# EasyEDA Pro project sardines-drying-circuit.eprj

# Schematic Schematic1
Board Name: Board1; Create Date: 2025-08-19; Page Name: P1; Project Name: sardines-drying-circuit; Schematic Name: Schematic1; Update Date: 2025-08-20; Company: EasyEDA.com; Page Size: A4; Version: V1.0
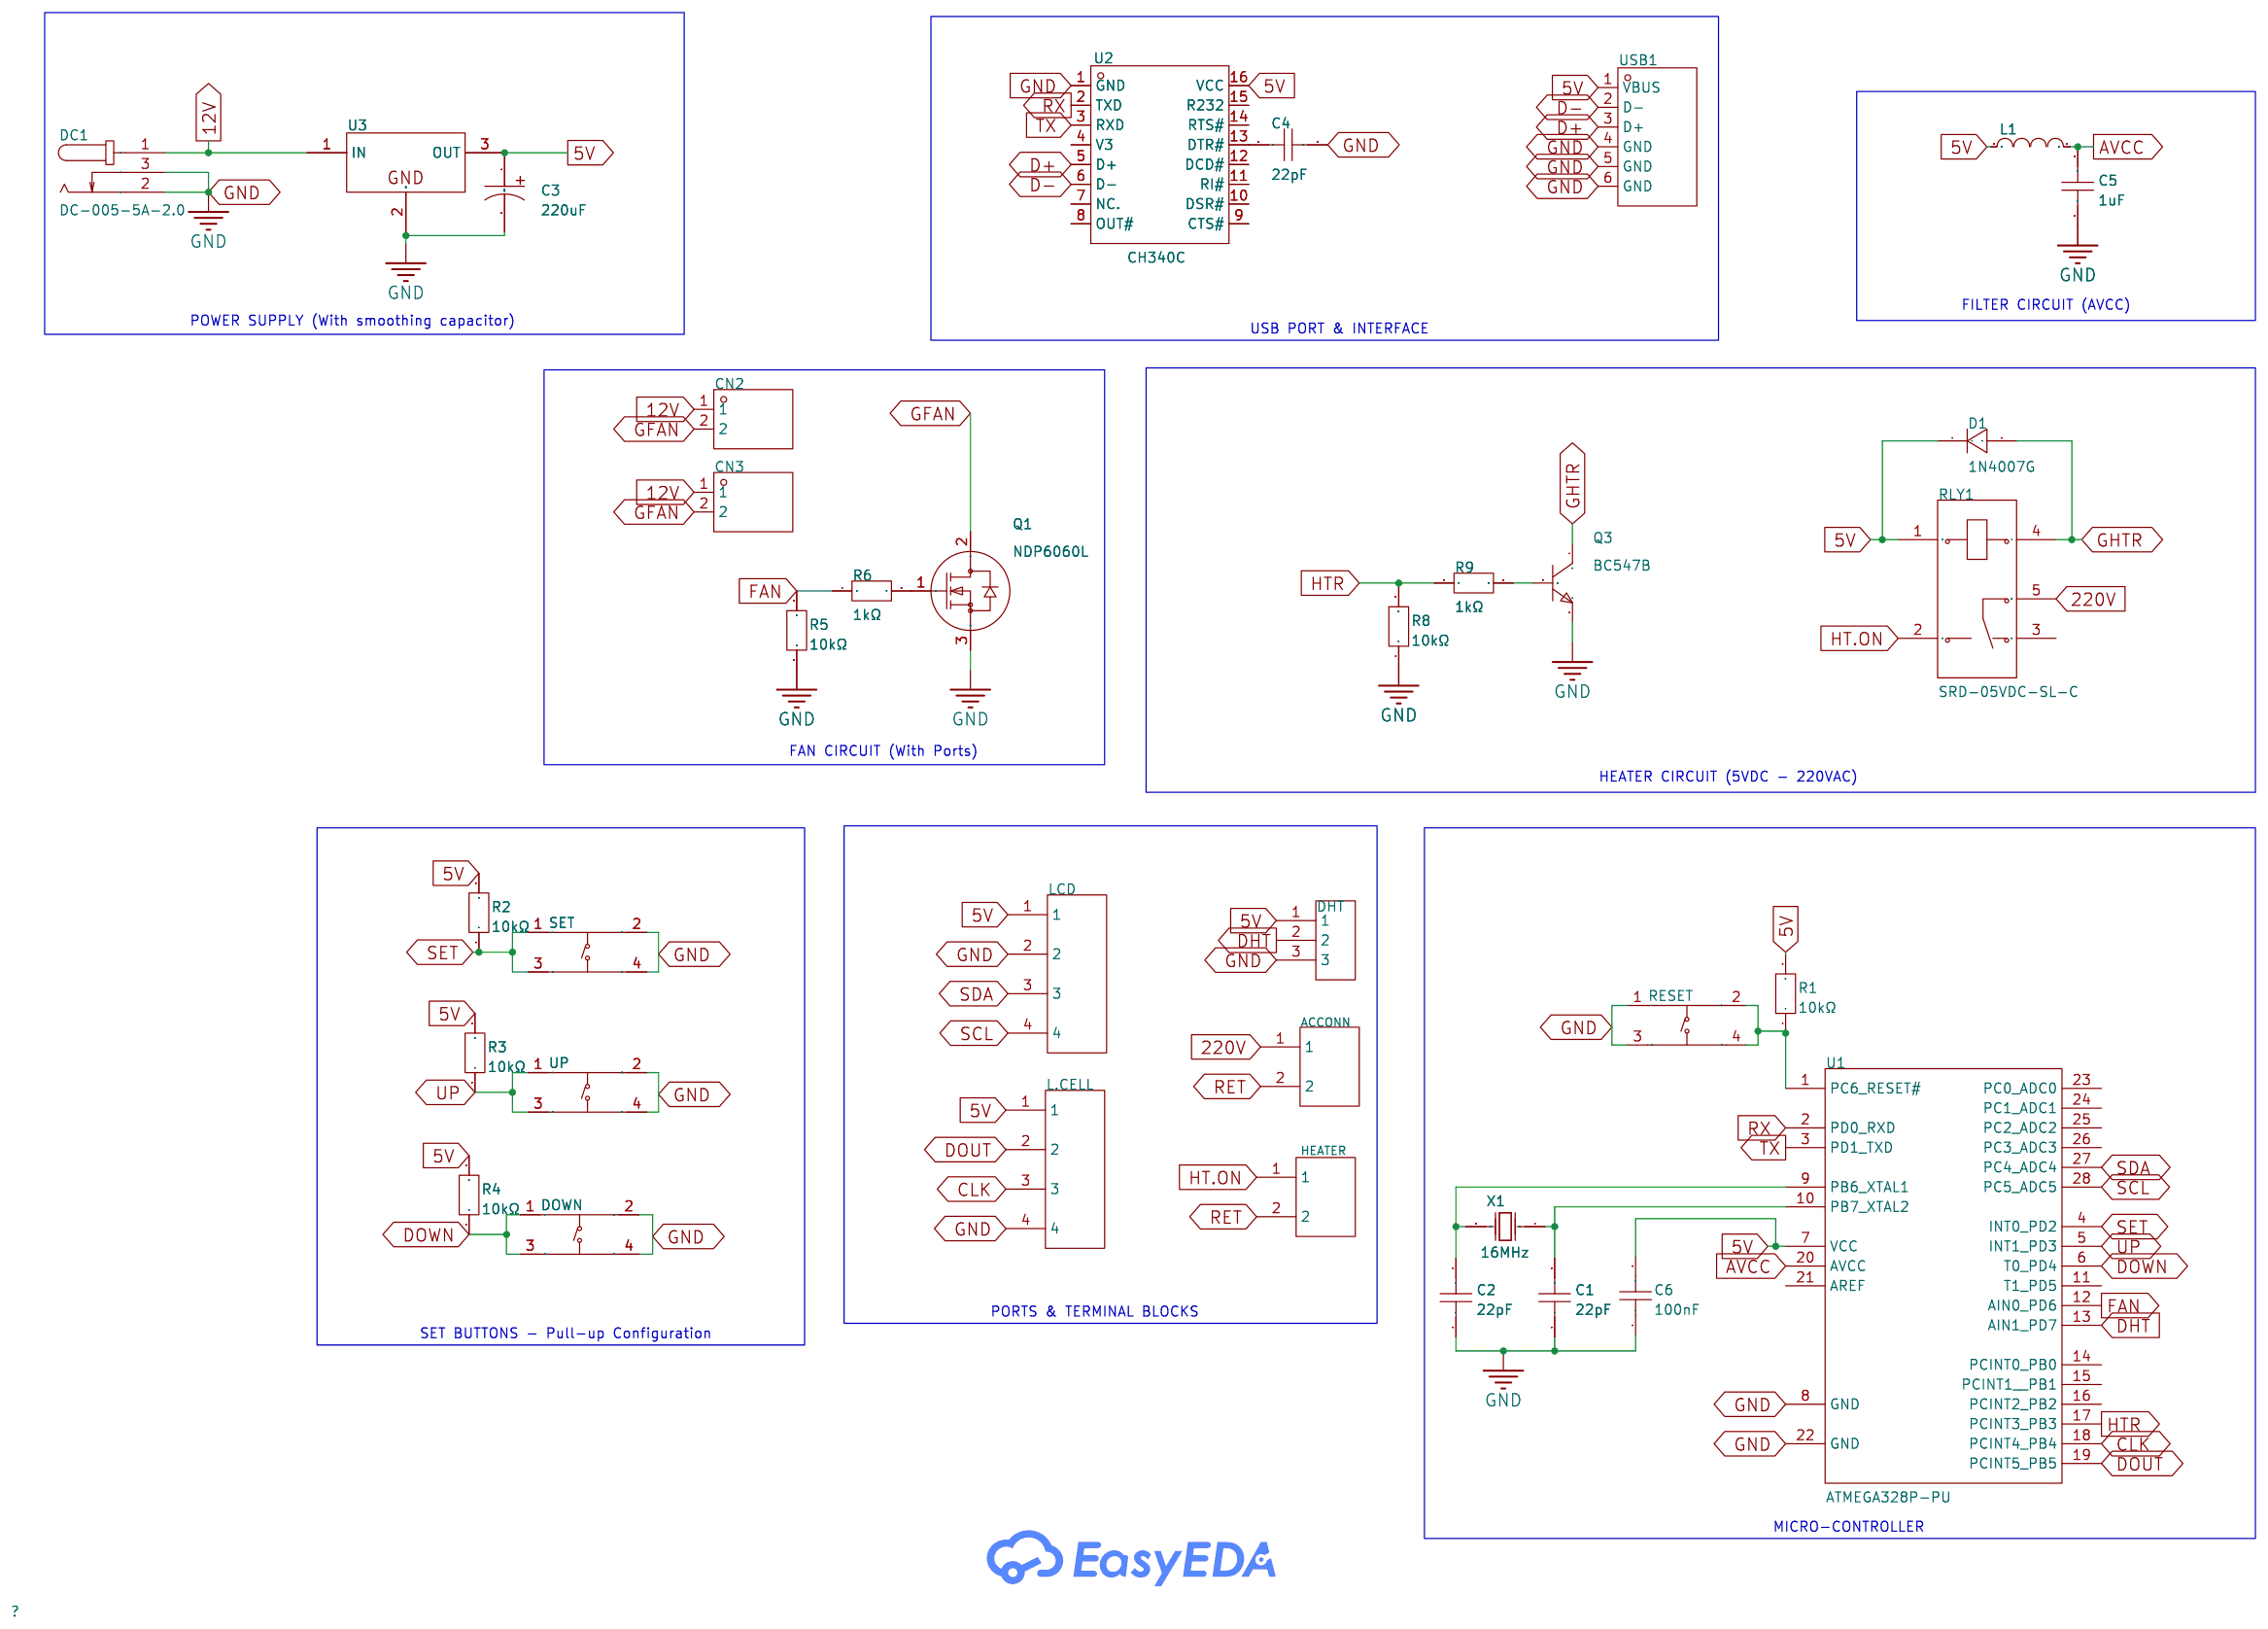
[diagram p0: schematic sheet]

## Parts
ACCONN  WJ35C-B-8.25-2P  [CONN-TH_2P-P8.25_WJ35C-B-2P]
C1  22pF  [CAP-TH_L5.8-W2.4-P2.54-D0.6]
C2  22pF  [CAP-TH_L5.8-W2.4-P2.54-D0.6]
C3  220uF  [CAP-TH_BD10.0-P5.00-D0.6-FD]
C4  22pF  [CAP-TH_L5.8-W2.4-P2.54-D0.6]
C5  1uF  [CAP-TH_L5.5-W3.5-P5.00-D1.2]
C6  100nF  [CAP-TH_L5.0-W2.5-P5.00-D1.0]
CN2  B2B-XH-A(LF)(SN)  [CONN-TH_B2B-XH-A-LF-SN]
CN3  B2B-XH-A(LF)(SN)  [CONN-TH_B2B-XH-A-LF-SN]
D1  1N4007G  [DO-41_BD2.4-L4.7-P8.70-D0.9-RD]
DC1  DC-005-5A-2.0  [DC-IN-TH_DC-005-5A-2.0]
DHT  B3B-XH-A(LF)(SN)  [CONN-TH_3P-P2.50_A2501WV2-3P]
DOWN  TS665CJ  [SW-TH_4P-L6.0-W6.0-P4.50-LS6.5]
HEATER  WJ35C-B-8.25-2P  [CONN-TH_2P-P8.25_WJ35C-B-2P]
L1  BLM18PG121SN1D  [L0603]
L.CELL  B4B-PH-K-S(LF)(SN)  [CONN-TH_B4B-PH-K-S]
LCD  B4B-PH-K-S(LF)(SN)  [CONN-TH_B4B-PH-K-S]
Q1  NDP6060L  [TO-220-3_L10.0-W4.5-P2.54-L]
Q3  BC547B  [TO-92-3_L4.9-W3.7-P1.27-L]
R1  10kΩ  [RES-TH_BD2.4-L6.3-P10.30-D0.6]
R2  10kΩ  [RES-TH_BD2.4-L6.3-P10.30-D0.6]
R3  10kΩ  [RES-TH_BD2.4-L6.3-P10.30-D0.6]
R4  10kΩ  [RES-TH_BD2.4-L6.3-P10.30-D0.6]
R5  10kΩ  [RES-TH_BD2.4-L6.3-P10.30-D0.6]
R6  1kΩ  [RES-TH_BD2.7-L6.2-P10.20-D0.4]
R8  10kΩ  [RES-TH_BD2.4-L6.3-P10.30-D0.6]
R9  1kΩ  [RES-TH_BD2.7-L6.2-P10.20-D0.4]
RESET  TS665CJ  [SW-TH_4P-L6.0-W6.0-P4.50-LS6.5]
RLY1  SRD-05VDC-SL-C  [RELAY-TH_SRD-XXVDC-XL-C]
SET  TS665CJ  [SW-TH_4P-L6.0-W6.0-P4.50-LS6.5]
U1  ATMEGA328P-PU  [DIP-28_L34.6-W7.3-P2.54-LS10.2-BL]
U2  CH340C  [SOP-16_L10.0-W3.9-P1.27-LS6.0-BL]
U3  L7805CV-DG  [TO-220-3_L10.0-W4.5-P2.54-L]
UP  TS665CJ  [SW-TH_4P-L6.0-W6.0-P4.50-LS6.5]
USB1  USB-B10-BRW  [USB-B-TH_USB-B10-BRW]
X1  16MHz  [OSC-TH_L10.0-W4.5-P5.00]

## Library data of the parts
ACCONN HEATER = WJ35C-B-8.25-2P: LCSC Part Name: 8.25mm 1x2P 每排P数:2 排数:1 直针 中脚; Supplier Part: C8450; Manufacturer: KANGNEX(康奈克斯电气); Supplier Footprint: 插件,P=8.25mm; JLCPCB Part Class: Extended Part; Datasheet: https://atta.szlcsc.com/upload/public/pdf/source/20191225/C8450_EAD2DB646252A17436BA258C5D308404.pdf; Supplier: LCSC; Barrier Type: 两面; Pitch: 8.25mm; Structure: 1x2P; Mounting Style: 直针; Pin Location: 中脚; Number of Pins: 2P; Number of Rows: 1; Current Rating (Max): 24A; Voltage Rating (Max): 250V; Wire Gauge - AWG: 14~22; Wire Gauge - mm2: 2.5; Operating Temperature Range: -40℃~+105℃; Color: Black; Number of PINs Per Row: 2
C1 C2 C4 = CC1H220KA1EDCH4B1100: LCSC Part Name: 22pF ±10% 50V; Supplier Part: C2832510; Manufacturer: Dersonic(德尔创); Supplier Footprint: 插件,P=2.54mm; JLCPCB Part Class: Extended Part; Datasheet: https://atta.szlcsc.com/upload/public/pdf/source/20211103/062C09467AB58979163D97626BAD0297.pdf; Supplier: LCSC; Tolerance: ±10%; Voltage Rating: 50V; Pin Spacing: 2.54mm; Temperature Coefficient: NP0; Diameter: 4.8mm; Body Thickness: 2.4mm
C3 = 50ZLJ220M10X12.5: LCSC Part Name: 220uF ±20% 50V; Supplier Part: C2923727; Manufacturer: Rubycon(红宝石); Supplier Footprint: 插件,D10xL12.5mm; JLCPCB Part Class: Extended Part; Datasheet: https://item.szlcsc.com/datasheet/50ZLJ220M10X12.5/3236351.html; Supplier: LCSC; Tolerance: ±20%; Voltage Rating: 50V; Pin Spacing: 5mm; Diameter: 10mm; Height - Seated (Max): 12.5mm; Operating Temperature: -40℃~+105℃
C5 = FK26X7R1H105KRE06: LCSC Part Name: 1uF ±10% 50V; Supplier Part: C2839237; Manufacturer: TDK; Supplier Footprint: 插件,P=5mm; JLCPCB Part Class: Extended Part; Datasheet: https://atta.szlcsc.com/upload/public/pdf/source/20211011/CA0C243CD946D294CDFF83D03DB16AD9.pdf; Supplier: LCSC; Tolerance: ±10%; Voltage Rating: 50V; Pin Spacing: 5mm; Temperature Coefficient: X7R
C6 = CC1H104MC1FD3F6C10MF: LCSC Part Name: 100nF ±20% 50V; Supplier Part: C254085; Manufacturer: Dersonic(德尔创); Supplier Footprint: 插件,P=5.08mm; JLCPCB Part Class: Extended Part; Datasheet: https://atta.szlcsc.com/upload/public/pdf/source/20200826/C254085_159DD65BF32BF11C9168D341BCE23E6F.pdf; Supplier: LCSC; Tolerance: ±20%; Voltage Rating: 50V; Pin Spacing: 5.08mm; Temperature Coefficient: Y5V; Diameter: 6mm; Body Thickness: 2.2mm
CN2 CN3 = B2B-XH-A(LF)(SN): LCSC Part Name: 1x2P 间距:2.5mm 直插 系列:XH; Supplier Part: C158012; Manufacturer: JST; Supplier Footprint: 插件,P=2.5mm; JLCPCB Part Class: Extended Part; Datasheet: https://item.szlcsc.com/datasheet/B2B-XH-A(LF)(SN)/169360.html; Supplier: LCSC; Pins Structure: 1x2P; Pitch: 2.5mm; Mounting Type: Through Hole; Reference Series: XH; Number of Pins: 2P; Number of Rows: 1; Number of PINs Per Row: 2; Current Rating: 3A; Contact Material: Brass; Contact Plating: Tin; Operating Temperature: -25℃~+85℃; Voltage Rating: 250V; Plastic Material: PA66; Flame Retardant Rating: UL94V-0; Supplementary Features: K Pin; Color: White; Z-Height of the Board: 7mm; X-Length of Bottom Edge on Board (Spacing Line): 7.4mm; Y-Width of Bottom Edge on Board: 5.75mm
D1 = 1N4007G_C232439: Supplier Part: C232439; Manufacturer: onsemi(安森美); Supplier Footprint: DO-41; JLCPCB Part Class: Extended Part; Datasheet: https://item.szlcsc.com/datasheet/1N4007G/232362.html; Supplier: LCSC; Voltage - Forward(Vf@If): 930mV@1A; Voltage - DC Reverse(Vr): 1kV; Current - Rectified: 1A; Reverse Leakage Current (Ir): 50nA@1kV; Non-Repetitive Peak Forward Surge Current: 30A; Operating Junction Temperature Range: -65℃~+175℃
DC1 = DC-005-5A-2.0: LCSC Part Name: DC电源插座 内径:2mm 外径:6.2mm; Supplier Part: C381116; Manufacturer: XKB Connection(中国星坤); Supplier Footprint: 插件; JLCPCB Part Class: Extended Part; Datasheet: https://atta.szlcsc.com/upload/public/pdf/source/20211015/707A35F7AB6E89C57AAB641950105BB7.pdf; Supplier: LCSC; Connector Type: DC Power Receptacle; Mounting Style: Bend insert; Inside Contact Diameter: 2mm; Outside Contact Diameter: 6.2mm; Current Rating (Max): 5A; Voltage Rating (Max): 24V; Operating Temperature Range: -20℃~+70℃
DHT = B3B-XH-A(LF)(SN): LCSC Part Name: 1x3P 间距:2.5mm 直插 系列:XH; Supplier Part: C144394; Manufacturer: JST; Supplier Footprint: 插件,P=2.5mm; JLCPCB Part Class: Extended Part; Datasheet: https://atta.szlcsc.com/upload/public/pdf/source/20180928/C265283_F9DFEEBDB2CF642B6BDFAB4B77BD2680.pdf; Supplier: LCSC; Pins Structure: 1x3P; Pitch: 2.5mm; Mounting Style: Direct Insert; Reference Series: XH; Number of Pins: 3P; Number of Rows: 1; Number of PINs Per Row: 3; Current Rating (Max): 3A; Contact Material: Brass; Contact Plating: Tin; Operating Temperature Range: -25℃~+85℃; Rated Voltage (Max): 250V; Plastic Material: PA66; Flame Retardant Rating: UL94V-0; Supplementary Features: K-leg punch; Colour: White; Z-Height of the Board: 7mm; X-Length of Bottom Edge on Board (Spacing Line): 9.9mm; Y-Width of Bottom Edge on Board: 5.75mm
DOWN RESET SET UP = TS665CJ: LCSC Part Name: 6*6*5mm 直插 轻触开关; Supplier Part: C393938; Manufacturer: SHOU HAN(首韩); Supplier Footprint: 插件; JLCPCB Part Class: Extended Part; Datasheet: https://atta.szlcsc.com/upload/public/pdf/source/20190521/C393938_BDABEAC600B4C55E200A80AA129B70BC.pdf; Supplier: LCSC; Circuit: SPST; Actuator Style: Round Button; Mounting Style: Straight; Switch Length: 6mm; Switch Width: 6mm; Switch Height: 5mm; Contact Current: 50mA; Voltage Rating (DC): 12V
L1 = BLM18PG121SN1D_C14709: LCSC Part Name: 单路 0603磁珠 阻抗120Ω@100MHz; Supplier Part: C14709; Manufacturer: muRata(村田); Supplier Footprint: 0603; JLCPCB Part Class: Basic Part; Datasheet: https://atta.szlcsc.com/upload/public/pdf/source/20130704/1457706621422.pdf; Supplier: LCSC; Impedance @ Frequency: 120Ω@100MHz; Tolerance: ±25%; DC Resistance: 50mΩ; Current Rating: 2A; Circuits: 1
L.CELL LCD = B4B-PH-K-S(LF)(SN)_C131334: LCSC Part Name: 1x4P 间距:2mm 直插 系列:PH; Supplier Part: C131334; Manufacturer: JST; Supplier Footprint: 插件,P=2mm; JLCPCB Part Class: Extended Part; Datasheet: https://atta.szlcsc.com/upload/public/pdf/source/20171026/C131342_15089839687311058815.pdf; Supplier: LCSC; Pins Structure: 1x4P; Pitch: 2mm; Mounting Style: Direct Insert; Reference Series: PH; Number of Pins: 4P; Number of Rows: 1; Number of PINs Per Row: 4; Current Rating (Max): 2A; Contact Material: Brass; Contact Plating: Tin; Operating Temperature Range: -25℃~+85℃; Rated Voltage (Max): 100V; Plastic Material: PA66; Flame Retardant Rating: UL94V-0; Supplementary Features: K-leg punch; Colour: White; Z-Height of the Board: 6mm; X-Length of Bottom Edge on Board (Spacing Line): 9.9mm; Y-Width of Bottom Edge on Board: 4.5mm
Q1 = NDP6060L: LCSC Part Name: 1个N沟道 耐压:60V 电流:48A; Supplier Part: C158097; Manufacturer: onsemi(安森美); Supplier Footprint: TO-220; JLCPCB Part Class: Extended Part; Datasheet: https://atta.szlcsc.com/upload/public/pdf/source/20180613/C158097_2257CB436A926D20150ACB430C7C2482.pdf; Supplier: LCSC; Type: 1个NChannel; Drain Source On Resistance (RDS(on)@Vgs,Id): 20mΩ@10V,24A; Gate Threshold Voltage (Vgs(th)@Id): 2V@250uA; Total Gate Charge (Qg@Vgs): 60nC@5V; Input Capacitance (Ciss@Vds): 2nF@25V; Operating Temperature: -65℃~+175℃@(Tj)
Q3 = BC547B: Supplier Part: C713613; Manufacturer: LGE(鲁光); Supplier Footprint: TO-92-3; JLCPCB Part Class: Extended Part; Datasheet: https://atta.szlcsc.com/upload/public/pdf/source/20200731/C713612_A87215DC84F647A4351B6D1248DC2A9A.pdf; Supplier: LCSC; type: NPN; Pd - Power Dissipation: 625mW; DC Current Gain: 200@2mA,5V; Transition frequency(fT): 150MHz; Current - Collector Cutoff: 100nA; Vce Saturation(VCE(sat)): 300mV
R1-R5 R8 = RN1/4W10KFT/BA1: LCSC Part Name: 10kΩ ±1% 250mW 金属膜电阻; Supplier Part: C410695; Manufacturer: Tyohm(幸亚电阻); Supplier Footprint: 插件,D2.4xL6.5mm; JLCPCB Part Class: Extended Part; Datasheet: https://atta.szlcsc.com/upload/public/pdf/source/20250211/2C0505E212032D72CE625B2E6B5197BA.pdf; Supplier: LCSC; Type: Metal Film Resistors; Tolerance: ±1%; Voltage-Supply(Max): 250V; Power(Watts): 250mW; Temperature Coefficient: ±50ppm/℃; Operating Temperature: -55℃~+125℃
R6 R9 = MF1/4W-1K±1%-ST52: LCSC Part Name: 金属膜电阻 1kΩ ±1% 250mW; Supplier Part: C2903245; Manufacturer: VO(翔胜); Supplier Footprint: 插件,D2.7xL6.2mm; JLCPCB Part Class: Extended Part; Datasheet: https://atta.szlcsc.com/upload/public/pdf/source/20241217/72FEFC4F99972FE0FB9B38B807463E29.pdf; Supplier: LCSC; Type: Metal Film Resistor; Tolerance: ±1%; Voltage-Supply(Max): 250V; Power(Watts): 250mW; Temperature Coefficient: ±100ppm/℃; Operating Temperature: -55℃~+155℃
RLY1 = SRD-05VDC-SL-C: LCSC Part Name: 蓝色 单组转换型继电器; Supplier Part: C35449; Manufacturer: 松乐; Supplier Footprint: 插件,15.6x19.2mm; JLCPCB Part Class: Extended Part; Datasheet: https://item.szlcsc.com/datasheet/SRD-05VDC-SL-C/36422.html; Supplier: LCSC; Coil Voltage: 5V; Contact Form: 1 Form C: 1C (SPDT-CO); Number of Pins: 5; Switching Voltage(Max): 250V@AC; Coil Rated Power: 360mW; Switching Current(Max): 15A; Coil Type: Non-Polarized - Single Coil; Coil Resistance: 70Ω; Contact Resistance: 100mΩ; Operate Time: 10ms; Release Time: 10ms
U1 = ATMEGA328P-PU: LCSC Part Name: MSL=1 基于AVR增强型RISC架构的低功耗CMOS 8位微控制器; Supplier Part: C33901; Manufacturer: MICROCHIP(美国微芯); Supplier Footprint: DIP-28-300mil; JLCPCB Part Class: Extended Part; Datasheet: https://atta.szlcsc.com/upload/public/pdf/source/20150124/1457707257819.pdf; Supplier: LCSC; CPU Core: AVR; CPU Maximum Speed: 20MHz; Program Storage Size: 32KB; Program Memory Type: FLASH; Number of I/O: 23; ADC (Bit): 10bit; Voltage - Supply: 1.8V~5.5V
U2 = CH340C: Supplier Part: C84681; Manufacturer: WCH(南京沁恒); Supplier Footprint: SOP-16; JLCPCB Part Class: Extended Part; Datasheet: https://atta.szlcsc.com/upload/public/pdf/source/20250604/33626338A5406B1E2A8163A86C0531AF.pdf; Supplier: LCSC; Applications Function: Transceiver; USB Protocol: USB 2.0; Voltage - Supply: 3.3V；5V; Data Rate: 2Mbps
U3 = L7805CV-DG: LCSC Part Name: 正稳压器IC; Supplier Part: C3795; Manufacturer: ST(意法半导体); Supplier Footprint: TO-220; JLCPCB Part Class: Extended Part; Datasheet: https://atta.szlcsc.com/upload/public/pdf/source/20140724/1457707163191.pdf; Supplier: LCSC; Output Type: Fixed; Maximum Input Voltage: 35V; Output Voltage: 5V; Output Current: 1.5A; Power Supply Rejection Ratio (PSRR): 62dB@(120Hz); Dropout Voltage: 2V@(1A); standby current: 8mA; Feature: Short-Circuit  Protection；Thermal Protection(TSD)；Overcurrent Protection(OCP); Operating Temperature: 0℃~+125℃; Output Polarity: Positive electrode; Number of Outputs: 1
USB1 = USB-B10-BRW: LCSC Part Name: Type-B 母 弯插; Supplier Part: C720549; Manufacturer: XUNPU(讯普); Supplier Footprint: 插件; JLCPCB Part Class: Extended Part; Datasheet: https://atta.szlcsc.com/upload/public/pdf/source/20250509/509D619DD0CCB5486DC2FFE6A65488BF.pdf; Supplier: LCSC; Connector Type: Type-B; Protocol Standard: USB 2.0; Gender: Female; Mounting Type: Right-Angle; Number of Contacts: 4P; Number of Ports: 1; Current Rating-Power: 1.5A; Operating Temperature: -20℃~+70℃
X1 = X49SD16MSD2SC: LCSC Part Name: HC-49US 16MHZ 2P 49S 20PF ±20PPM -20~70℃ (±30PPM); Supplier Part: C16212; Manufacturer: YXC(扬兴晶振); Supplier Footprint: HC-49S; JLCPCB Part Class: Extended Part; Datasheet: https://atta.szlcsc.com/upload/public/pdf/source/20240329/977D7F2434F98B2BE33270BB9FF3D86D.pdf; Supplier: LCSC; Type: Through-Hole Crystal Oscillator; Normal temperature Frequency Tolerance: ±20ppm; Load Capacitance: 20pF; Frequency Stability: ±30ppm; Operating Temperature: -20℃~+70℃

## Nets
5V: C3.1 C6.2 D1.1 DHT.1 L1.1 L.CELL.1 LCD.1 R1.2 R2.2 R3.2 R4.2 RLY1.1 U1.7(VCC) U2.16(VCC) U3.3(OUT) USB1.1(VBUS)
12V: CN2.1 CN3.1 DC1.1 U3.1(IN)
220V: ACCONN.1 RLY1.5
AVCC: C5.2 L1.2 U1.20(AVCC)
GND: C1.1 C2.1 C3.2 C4.1 C5.1 C6.1 DC1.2 DC1.3 DHT.3 DOWN.2(B) DOWN.4(D) L.CELL.4 LCD.2 Q1.3(S) Q3.3(E) R5.1 R8.1 RESET.1(A) RESET.3(C) SET.2(B) SET.4(D) U1.8(GND) U1.22(GND) U2.1(GND) U3.2(GND) UP.2(B) UP.4(D) USB1.4(GND) USB1.5(GND) USB1.6(GND)
CLK: L.CELL.3 U1.18(PCINT4 PB4)
D+: U2.5(D+) USB1.3(D+)
D-: U2.6(D-) USB1.2(D-)
DHT: DHT.2 U1.13(AIN1 PD7)
DOUT: L.CELL.2 U1.19(PCINT5 PB5)
DOWN: DOWN.1(A) DOWN.3(C) R4.1 U1.6(T0 PD4)
FAN: R5.2 R6.1 U1.12(AIN0 PD6)
GFAN: CN2.2 CN3.2 Q1.2(D)
GHTR: D1.2 Q3.1(C) RLY1.4
HT.ON: HEATER.1 RLY1.2
HTR: R8.2 R9.1 U1.17(PCINT3 PB3)
RET: ACCONN.2 HEATER.2
RX: U1.2(PD0 RXD) U2.2(TXD)
SCL: LCD.4 U1.28(PC5 ADC5)
SDA: LCD.3 U1.27(PC4 ADC4)
SET: R2.1 SET.1(A) SET.3(C) U1.4(INT0 PD2)
TX: U1.3(PD1 TXD) U2.3(RXD)
UP: R3.1 U1.5(INT1 PD3) UP.1(A) UP.3(C)
$1N1127: R1.1 RESET.2(B) RESET.4(D) U1.1(PC6 RESET#)
Net-(C1-2): C1.2 U1.10(PB7 XTAL2) X1.1(OSC1)
Net-(C2-2): C2.2 U1.9(PB6 XTAL1) X1.2(OSC2)
Net-(C4-2): C4.2 U2.13(DTR#)
Net-(Q1-1): Q1.1(G) R6.2
Net-(Q3-2): Q3.2(B) R9.2

Not connected (* = marked no-connect by the designer): RLY1 3; U1 11(T1 PD5) 14(PCINT0 PB0) 15(PCINT1  PB1) 16(PCINT2 PB2) 21(AREF) 23(PC0 ADC0) 24(PC1 ADC1) 25(PC2 ADC2) 26(PC3 ADC3); U2 4(V3) 7(NC.) 8(OUT#) 9(CTS#) 10(DSR#) 11(RI#) 12(DCD#) 14(RTS#) 15(R232)

## Notes on the sheet
- POWER SUPPLY (With smoothing capacitor)
- FILTER CIRCUIT (AVCC)
- USB PORT & INTERFACE
- FAN CIRCUIT (With Ports)
- HEATER CIRCUIT (5VDC - 220VAC)
- PORTS & TERMINAL BLOCKS
- SET BUTTONS - Pull-up Configuration
- MICRO-CONTROLLER

# Board PCB1
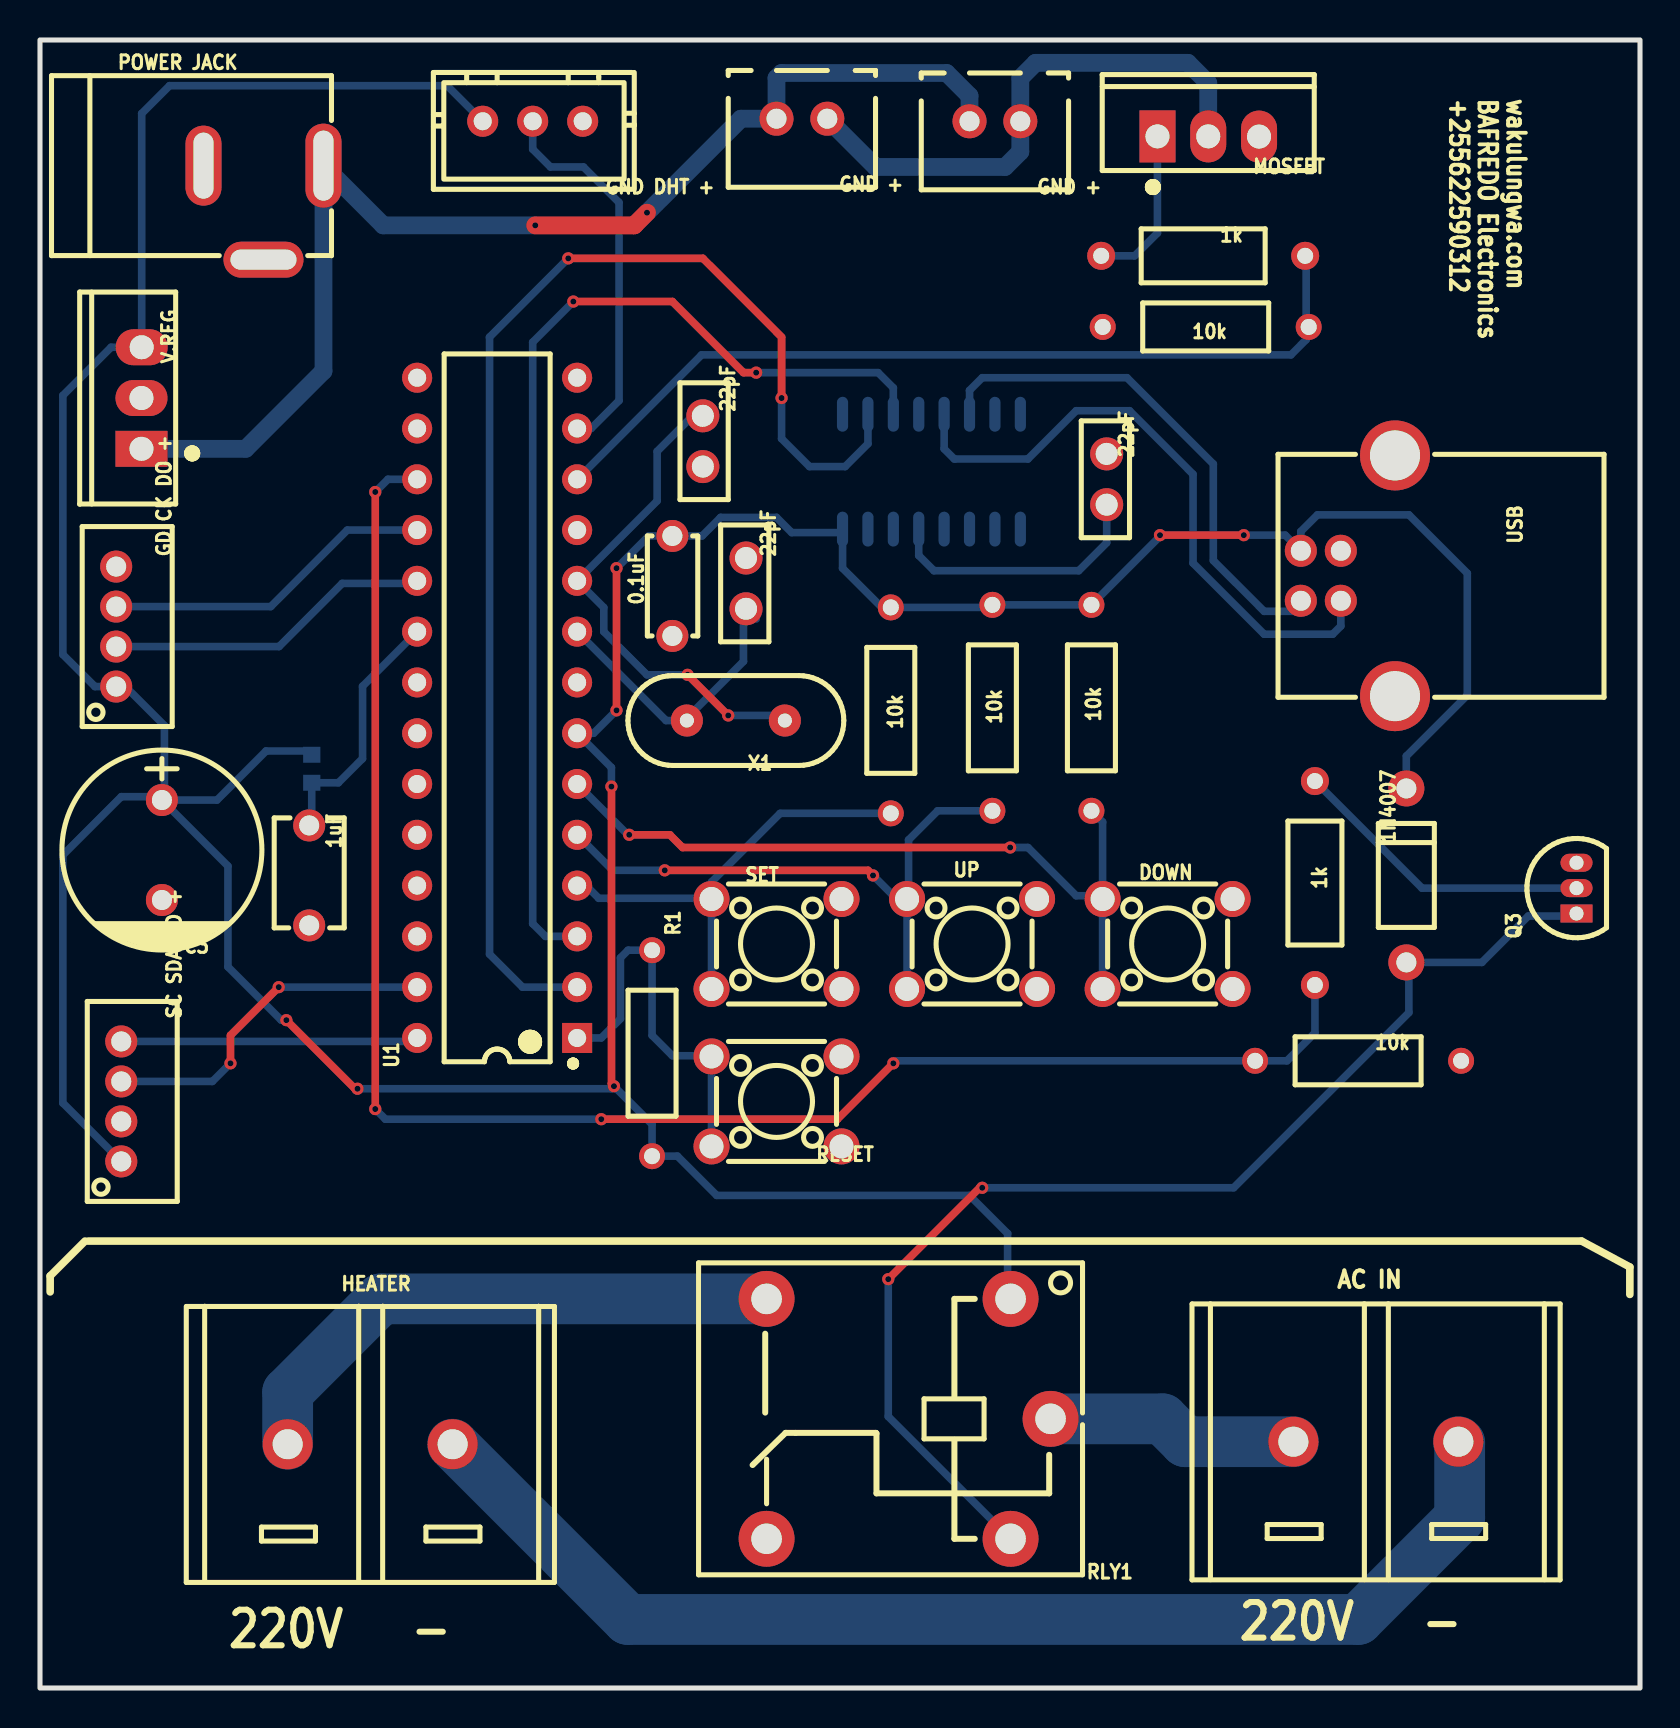
[diagram p1: board, top side]
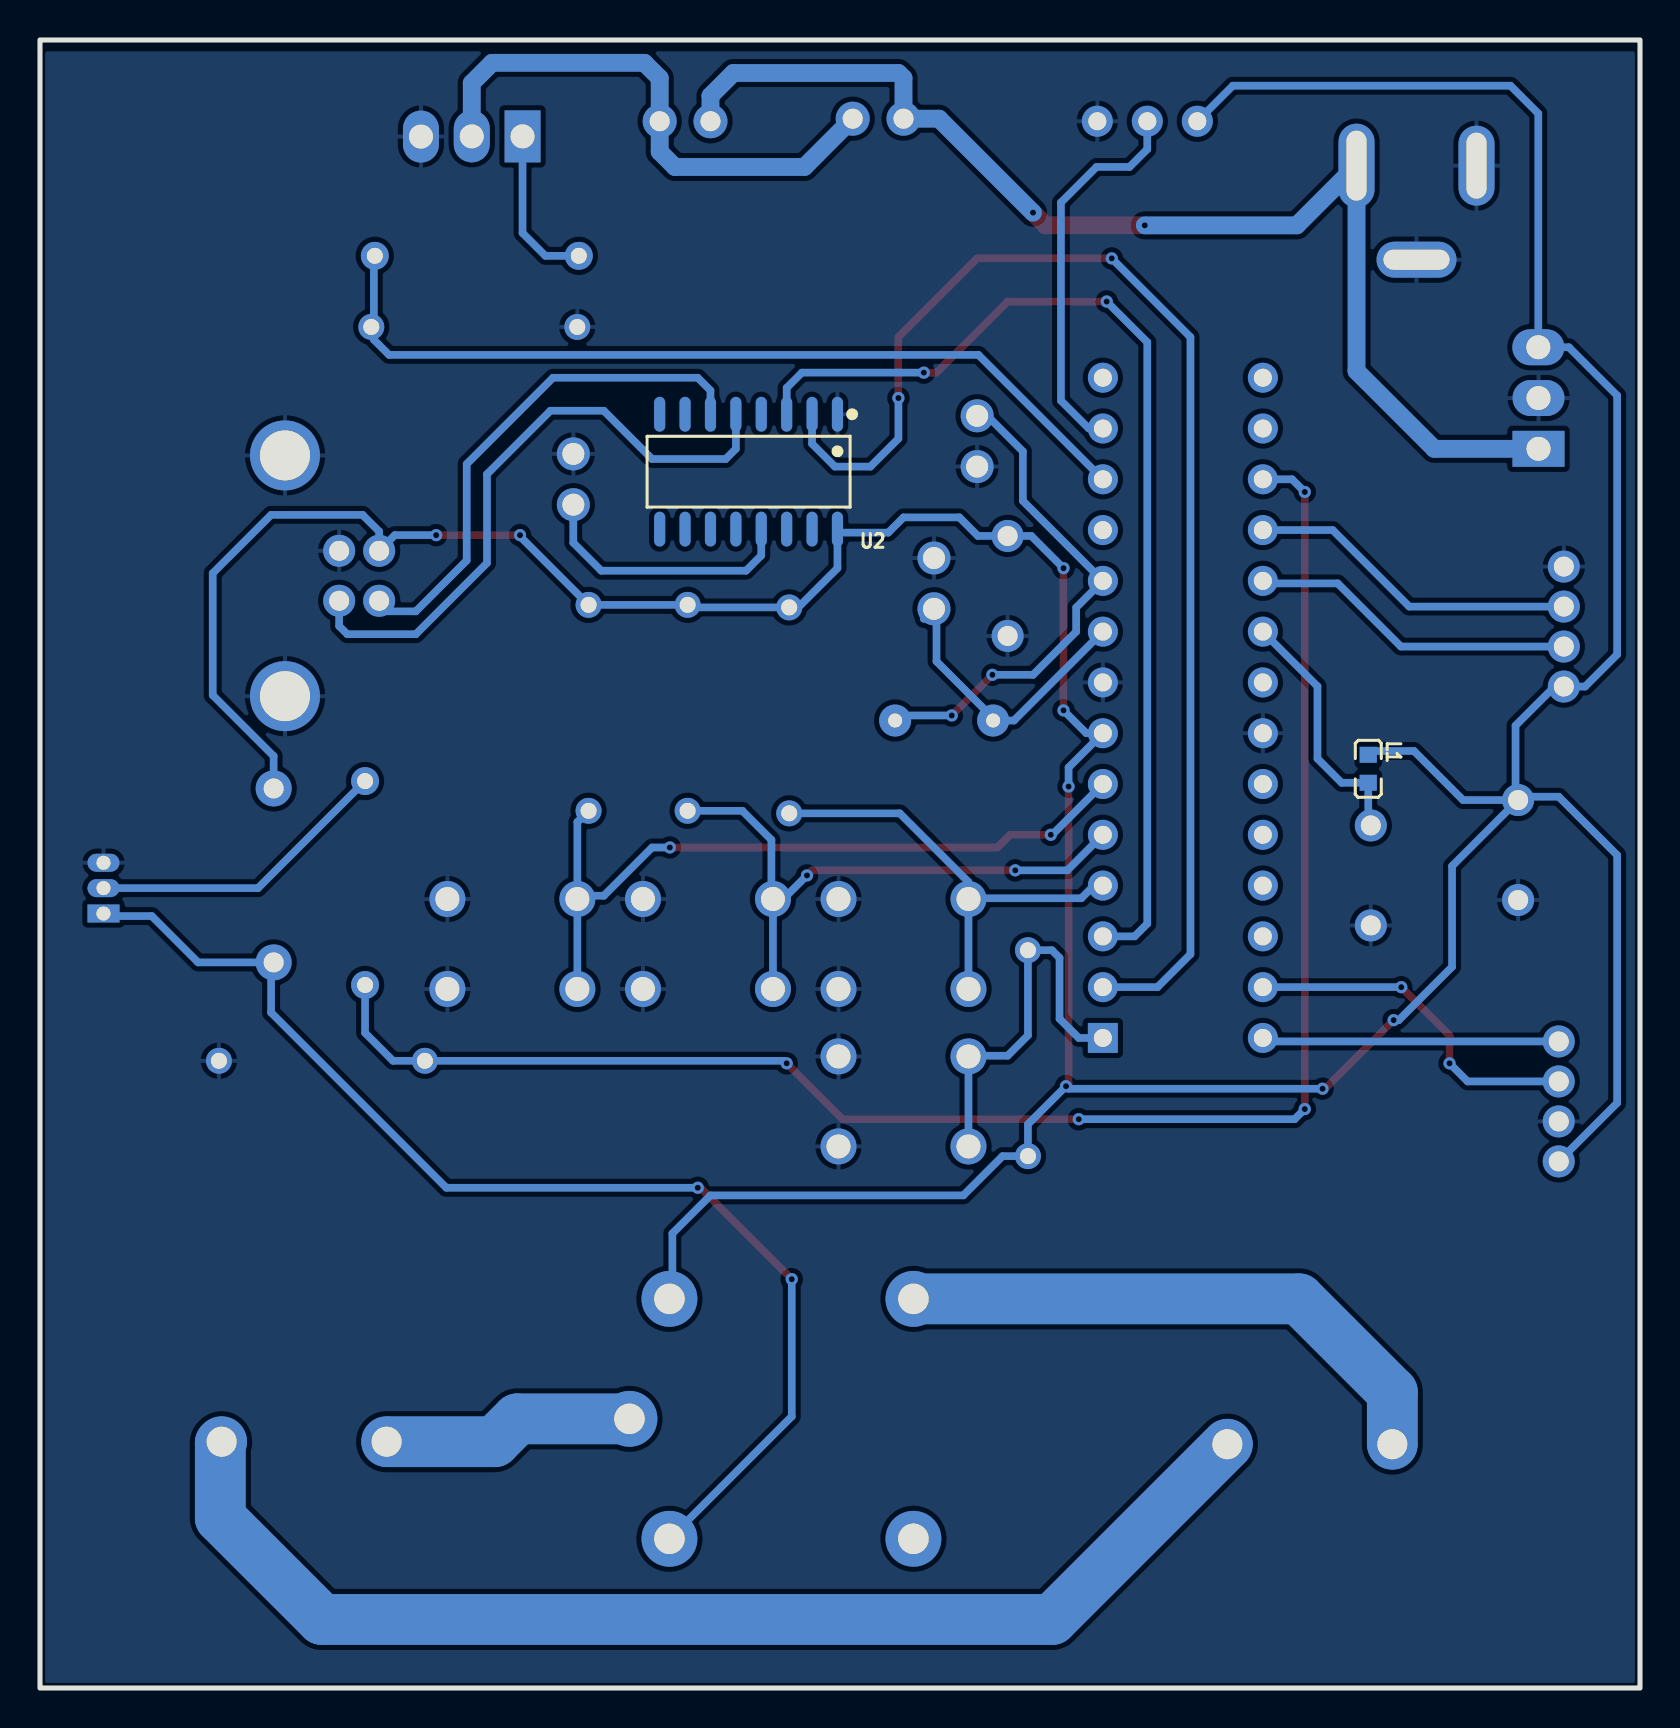
[diagram p2: board, bottom side, seen from below]

Outline 80.01 x 82.42 mm; copper layers: Top Layer, Bottom Layer. Coordinates in mm from the lower left corner of the outline.
Outline path: rectangle 0,82.42 80.01,0
Stack: Top Layer 0.035mm / Dielectric1 1.51mm FR4 er 4.5 / Bottom Layer 0.035mm

## Design rules (mm)
template: JLCPCB Capability(Two Layers Board)
spacing copperThickness1oz (default): track to track 0.102, other pairs 0.152 to 0.3
spacing copperThickness2oz: track to track 0.203, other pairs 0.152 to 0.3
track width copperThickness1oz (default): min 0.127, default 0.254, max 2.54
track width copperThickness2oz: min 0.203, default 0.254, max 2.54
differential pair differentialPair (default): width min 0.127, default 0.254, max 2.54; gap min 0.152, default 0.152
via viaSize (default): diameter min 0.5, default 0.61, max 10; hole min 0.3, default 0.305, max 6.3

## Placement (name value [footprint] x y rotation side)
0.1uF  100nF  [CAP-TH_L5.0-W2.5-P5.00-D1.0]  31.62 55.12 90 top
1k  -  [RES-TH_BD2.7-L6.2-P10.20-D0.4]  58.17 71.63 180 top
1k#2  -  [RES-TH_BD2.7-L6.2-P10.20-D0.4]  63.75 40.26 90 top
1N4007  1N4007G  [DO-41_BD2.4-L4.7-P8.70-D0.9-RD]  68.33 40.64 270 top
1uF  1uF  [CAP-TH_L5.5-W3.5-P5.00-D1.2]  13.46 40.64 90 top
10k  -  [RES-TH_BD2.4-L6.3-P10.30-D0.6]  42.54 48.89 90 top
10k#2  -  [RES-TH_BD2.4-L6.3-P10.30-D0.6]  47.62 49.02 90 top
10k#3  -  [RES-TH_BD2.4-L6.3-P10.30-D0.6]  52.58 49.02 90 top
10k#4  -  [RES-TH_BD2.4-L6.3-P10.30-D0.6]  58.29 68.07 0 top
10k#5  -  [RES-TH_BD2.4-L6.3-P10.30-D0.6]  65.91 31.37 180 top
22pF  -  [CAP-TH_L5.8-W2.4-P2.54-D0.6]  33.15 62.36 90 top
22pF#2  -  [CAP-TH_L5.8-W2.4-P2.54-D0.6]  35.31 55.24 270 top
22pF#3  -  [CAP-TH_L5.8-W2.4-P2.54-D0.6]  53.34 60.45 270 top
AC IN  WJ35C-B-8.25-2P  [CONN-TH_2P-P8.25_WJ35C-B-2P]  66.8 12.32 0 top
C3  220uF  [CAP-TH_BD10.0-P5.00-D0.6-FD]  6.1 41.91 270 top
DOWN  TS665CJ  [SW-TH_4P-L6.0-W6.0-P4.50-LS6.5]  56.39 37.21 0 top
GD CK DO +  B4B-PH-K-S(LF)(SN)  [CONN-TH_B4B-PH-K-S]  3.81 53.09 270 top
GND +  -  [CONN-TH_B2B-XH-A-LF-SN]  47.75 78.36 180 top
GND +#2  -  [CONN-TH_B2B-XH-A-LF-SN]  38.1 78.49 180 top
GND DHT +  B3B-XH-A(LF)(SN)  [CONN-TH_3P-P2.50_A2501WV2-3P]  24.64 78.36 0 top
HEATER  WJ35C-B-8.25-2P  [CONN-TH_2P-P8.25_WJ35C-B-2P]  16.51 12.19 0 top
L1  BLM18PG121SN1D  [L0603]  13.59 45.97 270 bottom
MOSFET  NDP6060L  [TO-220-3_L10.0-W4.5-P2.54-L]  58.42 77.6 0 top
POWER JACK  DC-005-5A-2.0  [DC-IN-TH_DC-005-5A-2.0]  11.18 73.79 0 top
Q3  BC547B  [TO-92-3_L4.9-W3.7-P1.27-L]  76.84 40 90 top
R1  10kΩ  [RES-TH_BD2.4-L6.3-P10.30-D0.6]  30.61 31.75 270 top
RESET  TS665CJ  [SW-TH_4P-L6.0-W6.0-P4.50-LS6.5]  36.83 29.34 180 top
RLY1  SRD-05VDC-SL-C  [RELAY-TH_SRD-XXVDC-XL-C]  43.43 13.46 180 top
SC SDA GD +  B4B-PH-K-S(LF)(SN)  [CONN-TH_B4B-PH-K-S]  4.06 29.34 270 top
SET  TS665CJ  [SW-TH_4P-L6.0-W6.0-P4.50-LS6.5]  36.83 37.21 0 top
U1  ATMEGA328P-PU  [DIP-28_L34.6-W7.3-P2.54-LS10.2-BL]  22.86 49.02 90 top
U2  CH340C  [SOP-16_L10.0-W3.9-P1.27-LS6.0-BL]  44.58 60.83 0 bottom
UP  TS665CJ  [SW-TH_4P-L6.0-W6.0-P4.50-LS6.5]  46.61 37.21 0 top
USB  USB-B10-BRW  [USB-B-TH_USB-B10-BRW]  65.41 55.63 90 top
V.REG  L7805CV-DG  [TO-220-3_L10.0-W4.5-P2.54-L]  5.08 64.52 90 top
X1  16MHz  [OSC-TH_L10.0-W4.5-P5.00]  34.8 48.39 270 top

## Footprints (pads in the part's own frame, mm; a bottom-side part is the same pattern mirrored in y, then rotated)
CAP-TH_BD10.0-P5.00-D0.6-FD
  round 1.6 hole 1: 1(-2.5,0) 2(2.5,0)
CAP-TH_L5.0-W2.5-P5.00-D1.0
  round 1.6 hole 1: 1(-2.5,0) 2(2.5,0)
CAP-TH_L5.5-W3.5-P5.00-D1.2
  round 1.6 hole 1: 1(-2.5,0) 2(2.5,0)
CAP-TH_L5.8-W2.4-P2.54-D0.6
  round 1.65 hole 1.1: 1(-1.27,0) 2(1.27,0)
CONN-TH_2P-P8.25_WJ35C-B-2P
  round 2.5 hole 1.5: 1(-4.125,0) 2(4.125,0)
CONN-TH_3P-P2.50_A2501WV2-3P
  round 1.55 hole 0.9: 1(-2.5,0) 2(0,0) 3(2.5,0)
CONN-TH_B2B-XH-A-LF-SN
  round 1.7 hole 1: 1(1.27,0) 2(-1.27,0)
CONN-TH_B4B-PH-K-S
  round 1.6 hole 1: 1(3,0) 2(1,0) 3(-1,0) 4(-3,0)
DC-IN-TH_DC-005-5A-2.0
  oval 1.8x4.2 hole 1x3.5: 1(3,2.352)
  oval 1.8x4 hole 1x3.3: 2(-3,2.352)
  oval 4x1.8 hole 3.3x1: 3(-0.001,-2.352)
DIP-28_L34.6-W7.3-P2.54-LS10.2-BL
  rect 1.5x1.5 hole 0.9: 1(-16.51,-4)
  round 1.5 hole 0.9: 2(-13.97,-4) 3(-11.43,-4) 4(-8.89,-4) 5(-6.35,-4) 6(-3.81,-4) 7(-1.27,-4) 8(1.27,-4) 9(3.81,-4) 10(6.35,-4) 11(8.89,-4) 12(11.43,-4) 13(13.97,-4) 14(16.51,-4) 15(16.51,4) 16(13.97,4) 17(11.43,4) 18(8.89,4) 19(6.35,4) 20(3.81,4) 21(1.27,4) 22(-1.27,4) 23(-3.81,4) 24(-6.35,4) 25(-8.89,4) 26(-11.43,4) 27(-13.97,4) 28(-16.51,4)
DO-41_BD2.4-L4.7-P8.70-D0.9-RD
  round 1.8 hole 1: 1(-4.35,0) 2(4.35,0)
L0603
  rect 0.8x0.864 smd: 1(-0.7,0) 2(0.7,0)
OSC-TH_L10.0-W4.5-P5.00
  round 1.6 hole 0.7: 1(0,2.45) 2(0,-2.45)
RELAY-TH_SRD-XXVDC-XL-C
  round 2.794 hole 1.524: 1(-5.1,-6) 2(7.1,-6) 3(7.1,6) 4(-5.1,6) 5(-7.1,0)
RES-TH_BD2.4-L6.3-P10.30-D0.6
  round 1.3 hole 0.8: 1(-5.15,0) 2(5.15,0)
RES-TH_BD2.7-L6.2-P10.20-D0.4
  round 1.4 hole 0.8: 1(-5.1,0) 2(5.1,0)
SOP-16_L10.0-W3.9-P1.27-LS6.0-BL
  oval 0.56x1.745 smd: 1(-4.445,-2.873) 2(-3.175,-2.873) 3(-1.905,-2.873) 4(-0.635,-2.873) 5(0.635,-2.873) 6(1.905,-2.873) 7(3.175,-2.873) 8(4.445,-2.873) 9(4.445,2.873) 10(3.175,2.873) 11(1.905,2.873) 12(0.635,2.873) 13(-0.635,2.873) 14(-1.905,2.873) 15(-3.175,2.873) 16(-4.445,2.873)
SW-TH_4P-L6.0-W6.0-P4.50-LS6.5
  round 1.8 hole 1.2: 1(-3.25,2.25) 2(3.25,2.25) 3(-3.25,-2.25) 4(3.25,-2.25)
TO-92-3_L4.9-W3.7-P1.27-L
  rect 0.9x1.6 hole 0.7: 1(-1.27,0)
  oval 0.9x1.6 hole 0.7: 2(0,0) 3(1.27,0)
TO-220-3_L10.0-W4.5-P2.54-L
  rect 1.8x2.6 hole 1.2: 1(-2.54,0.005)
  oval 1.8x2.6 hole 1.2: 2(0,0.005) 3(2.54,-0.005)
USB-B-TH_USB-B10-BRW
  round 1.6 hole 1: 1(1.25,2.355) 2(-1.25,2.355) 3(-1.25,0.355) 4(1.25,0.355)
  round 3.5 hole 2.5: 5(-6.02,-2.355) 6(6.02,-2.355)

## Nets
5V: 0.1uF.2 1N4007.1 10k.2 10k#2.2 10k#3.2 C3.1 GD CK DO +.1 GND DHT +.1 L1.1 R1.2 RLY1.1 SC SDA GD +.1 U1.7 U2.16 USB.1 V.REG.3
12V: GND +.1 GND +#2.1 POWER JACK.1 V.REG.1
220V: AC IN.1 RLY1.5
AVCC: 1uF.2 L1.2 U1.20
GND: 0.1uF.1 1uF.1 10k#4.1 10k#5.1 22pF.1 22pF#2.1 22pF#3.1 C3.2 DOWN.2 DOWN.4 GD CK DO +.4 GND DHT +.3 MOSFET.3 POWER JACK.2 POWER JACK.3 Q3.3 RESET.1 RESET.3 SC SDA GD +.2 SET.2 SET.4 U1.8 U1.22 U2.1 UP.2 UP.4 USB.4 USB.5 USB.6 V.REG.2
CLK: GD CK DO +.3 U1.18
D+: U2.5 USB.3
D-: U2.6 USB.2
DHT: GND DHT +.2 U1.13
DOUT: GD CK DO +.2 U1.19
DOWN: 10k#3.1 DOWN.1 DOWN.3 U1.6
FAN: 1k.1 10k#4.2 U1.12
GFAN: GND +.2 GND +#2.2 MOSFET.2
GHTR: 1N4007.2 Q3.1 RLY1.4
HT.ON: HEATER.1 RLY1.2
HTR: 1k#2.1 10k#5.2 U1.17
RET: AC IN.2 HEATER.2
RX: U1.2 U2.2
SCL: SC SDA GD +.4 U1.28
SDA: SC SDA GD +.3 U1.27
SET: 10k.1 SET.1 SET.3 U1.4
TX: U1.3 U2.3
UP: 10k#2.1 U1.5 UP.1 UP.3
$1N367: 22pF#2.2 U1.9 X1.2
$1N372: 22pF.2 U1.10 X1.1
$1N1127: R1.1 RESET.2 RESET.4 U1.1
$1N1310: 22pF#3.2 U2.13
$1N3453: 1k.2 MOSFET.1
$1N9148: 1k#2.2 Q3.2

Pads without a net: RLY1 3; U1 11 14 15 16 21 23 24 25 26; U2 4 7 8 9 10 11 12 14 15

## Via types
v1: diameter 0.61, hole 0.305, Top Layer to Bottom Layer, 28 vias

## Routing (per net, layer and track width the routed paths; a pad name or vN(x,y) marks a point on that pad's centre or on a via; arc(x,y) is an arc through that point)
5V: length 239.3
  Top Layer w0.381: v1(28.83,48.89) v1(28.83,56.01) ; v1(56.01,57.66) v1(60.2,57.66) ; v1(28.7,30.1) 28.57,30.23 v1(28.57,45.08) ; v1(15.88,29.97) 15.75,29.97 v1(12.32,33.4)
  Bottom Layer w0.381: v1(28.57,45.08) 28.57,46.04 U1.7 27.69,47.75 v1(28.83,48.89) ; L1.1 13.4,46.86 11.3,46.86 8.85,44.41 C3.1 ; C3.1 9.4,41.11 9.4,36.07 12.06,33.4 v1(12.32,33.4) ; C3.1 5.93,44.58 4.06,44.58 1.14,41.66 1.14,29.26 SC SDA GD +.1 ; C3.1 6.22,44.54 6.22,48.13 4.27,50.09 GD CK DO +.1 2.75,50.09 1.14,51.69 1.14,64.64 3.56,67.06 V.REG.3 5.08,78.74 6.48,80.14 20.36,80.14 GND DHT +.1 ; v1(15.88,29.97) 28.57,29.97 v1(28.7,30.1) 30.61,28.19 R1.2 31.88,26.6 33.84,24.64 46.48,24.64 48.39,22.73 48.39,19.61 RLY1.1 ; v1(56.01,57.66) 56.01,57.6 10k#3.2 10k#2.2 47.5,54.04 42.09,54.04 40.13,56.01 U2.16 39.96,57.78 37.59,57.78 36.83,58.55 34.04,58.55 33.11,57.62 0.1uF.2 30.44,57.62 v1(28.83,56.01) ; v1(60.2,57.66) 62.27,57.66 USB.1 63.05,57.84 63.88,58.67 68.45,58.67 71.37,55.75 71.37,49.66 68.33,46.61 1N4007.1
12V: length 60.6
  Top Layer w0.889: v1(30.35,73.79) 29.72,73.15 v1(24.76,73.15)
  Bottom Layer w0.889: v1(24.76,73.15) 17.16,73.15 POWER JACK.1 14.18,65.86 10.29,61.98 V.REG.1 ; v1(30.35,73.79) 35.05,78.49 GND +#2.1 36.83,80.52 37.08,80.77 45.34,80.77 46.48,79.63 GND +.1
220V: length 12.6
  Bottom Layer w2.54: AC IN.1 57.28,12.32 56.13,13.46 RLY1.5
AVCC: length 12.7
  Bottom Layer w0.381: 1uF.2 13.59,43.27 L1.2 14.92,45.27 16.13,46.48 16.13,50.1 U1.20
CLK: length 16.6
  Bottom Layer w0.381: U1.18 15.37,57.91 11.54,54.09 GD CK DO +.3
D+: length 31.4
  Bottom Layer w0.381: USB.3 65.05,53.11 64.64,52.7 61.21,52.7 57.66,56.26 57.66,60.71 54.48,63.88 51.82,63.88 49.4,61.47 45.72,61.47 45.21,61.98 U2.5
D-: length 26.2
  Bottom Layer w0.381: USB.2 63.05,53.87 63.03,53.85 61.21,53.85 58.67,56.39 58.67,61.21 54.36,65.53 47.12,65.53 46.48,64.9 U2.6
DHT: length 19.4
  Bottom Layer w0.381: U1.13 27.56,62.99 28.96,64.39 28.96,74.29 27.18,76.07 25.53,76.07 24.64,76.96 GND DHT +.2
DOUT: length 16.4
  Bottom Layer w0.381: GD CK DO +.2 11.95,52.09 15.11,55.24 18.73,55.24 U1.19
DOWN: length 37.8
  Top Layer w0.381: v1(29.46,42.67) 31.5,42.67 32.13,42.04 v1(48.51,42.04)
  Bottom Layer w0.381: U1.6 29.4,42.67 v1(29.46,42.67) ; 10k#3.1 53.14,43.31 DOWN.1 ; v1(48.51,42.04) 49.4,42.04 51.82,39.62 52.97,39.62 DOWN.1 ; DOWN.1 DOWN.3
FAN: length 43.6
  Bottom Layer w0.381: U1.12 33.08,66.67 62.55,66.67 63.32,67.44 63.32,71.58 1k.1
GFAN: length 27.4
  Bottom Layer w0.889: MOSFET.2 58.42,80.26 57.4,81.28 49.78,81.28 49.02,80.52 49.02,76.83 48.26,76.07 41.78,76.07 GND +#2.2
GHTR: length 59.2
  Top Layer w0.381: v1(42.42,20.45) 46.99,25.02 v1(47.12,25.02)
  Bottom Layer w0.381: v1(47.12,25.02) 59.69,25.02 68.45,33.78 68.45,36.16 1N4007.2 72.1,36.29 74.42,38.61 76.71,38.61 Q3.1 ; v1(42.42,20.45) 42.42,13.58 RLY1.4
HT.ON: length 28.5
  Bottom Layer w2.54: RLY1.2 17.05,19.46 12.39,14.8 HEATER.1
HTR: length 84.6
  Top Layer w0.381: v1(28.07,28.45) 39.88,28.45 v1(42.67,31.24) ; v1(16.76,59.82) v1(16.76,28.96)
  Bottom Layer w0.381: v1(28.07,28.45) 17.27,28.45 v1(16.76,28.96) ; U1.17 17.4,60.45 v1(16.76,59.82) ; 1k#2.1 63.75,32.77 62.36,31.37 10k#5.2 42.8,31.37 v1(42.67,31.24)
RET: length 59.9
  Bottom Layer w2.54: AC IN.2 70.99,12.25 70.99,8.51 65.91,3.43 29.4,3.43 HEATER.2
RX: length 65.7
  Top Layer w0.381: v1(26.42,71.5) 33.15,71.5 37.08,67.56 v1(37.08,64.52)
  Bottom Layer w0.381: v1(37.08,64.52) 37.08,62.48 38.48,61.09 40.26,61.09 41.4,62.23 U2.2 ; v1(26.42,71.5) 22.48,67.56 22.48,36.7 24.13,35.05 U1.2
SCL: length 14.9
  Bottom Layer w0.381: U1.28 18.69,32.34 SC SDA GD +.4
SDA: length 17.6
  Top Layer w0.381: v1(11.94,35.05) 9.52,32.64 v1(9.52,31.24)
  Bottom Layer w0.381: v1(11.94,35.05) U1.27 ; SC SDA GD +.3 8.62,30.34 v1(9.52,31.24)
SET: length 22.7
  Bottom Layer w0.381: 10k.1 37.01,43.74 33.58,40.31 SET.1 ; SET.1 SET.3 ; SET.1 33.54,39.5 27.94,39.5 27.31,40.13 U1.4
TX: length 53.6
  Top Layer w0.381: v1(35.81,65.79) 35.18,65.79 31.62,69.34 v1(26.67,69.34)
  Bottom Layer w0.381: U2.3 42.67,65.02 41.91,65.79 v1(35.81,65.79) ; U1.3 25.27,37.59 24.64,38.23 24.64,67.31 v1(26.67,69.34)
UP: length 30.1
  Top Layer w0.381: v1(41.66,40.64) 41.4,40.89 v1(31.24,40.89)
  Bottom Layer w0.381: v1(41.66,40.64) 42.84,39.46 UP.1 ; UP.1 43.43,39.54 43.43,42.42 44.89,43.87 10k#2.1 ; UP.1 UP.3 ; U1.5 28.64,40.89 v1(31.24,40.89)
$1N367: length 14.2
  Bottom Layer w0.381: U1.9 31.31,48.39 X1.2 32.35,48.51 35.18,51.34 35.18,53.47 35.81,53.47
$1N372: length 25.1
  Top Layer w0.381: v1(32.38,50.67) v1(34.42,48.64)
  Bottom Layer w0.381: v1(32.38,50.67) 30.35,50.67 28.19,52.83 28.19,54.04 U1.10 30.86,59.37 30.86,61.85 32.64,63.63 22pF.2 ; v1(34.42,48.64) 36.99,48.64 X1.1
$1N1127: length 19.5
  Bottom Layer w0.381: U1.1 28.07,32.51 29.03,33.47 29.03,36.52 29.41,36.9 R1.1 30.61,32.64 31.62,31.62 33.54,31.62 RESET.4 RESET.2
$1N1310: length 13.5
  Bottom Layer w0.381: 22pF#3.2 53.34,57.28 51.94,55.88 44.7,55.88 43.94,56.64 U2.13
$1N3453: length 8.1
  Bottom Layer w0.381: 1k.2 54.74,71.63 55.88,72.77 MOSFET.1
$1N9148: length 15.3
  Bottom Layer w0.381: Q3.2 69.11,40 1k#2.2

## Copper pours and planes (outline as drawn; the poured copper is in the pictures)
GND on Bottom Layer: 0,81.86 79.76,81.86 79.76,0.25 0,0.25

## Text on the board
Top Silkscreen Layer: wakulungwa.com / BAFREDO Electronics / +255622590312 | 220V   -
